# Altium schematic sheet Discrete_3V3_Linear_Regulator.SchDoc
size A; SheetNumber: 1; SheetTotal: 1
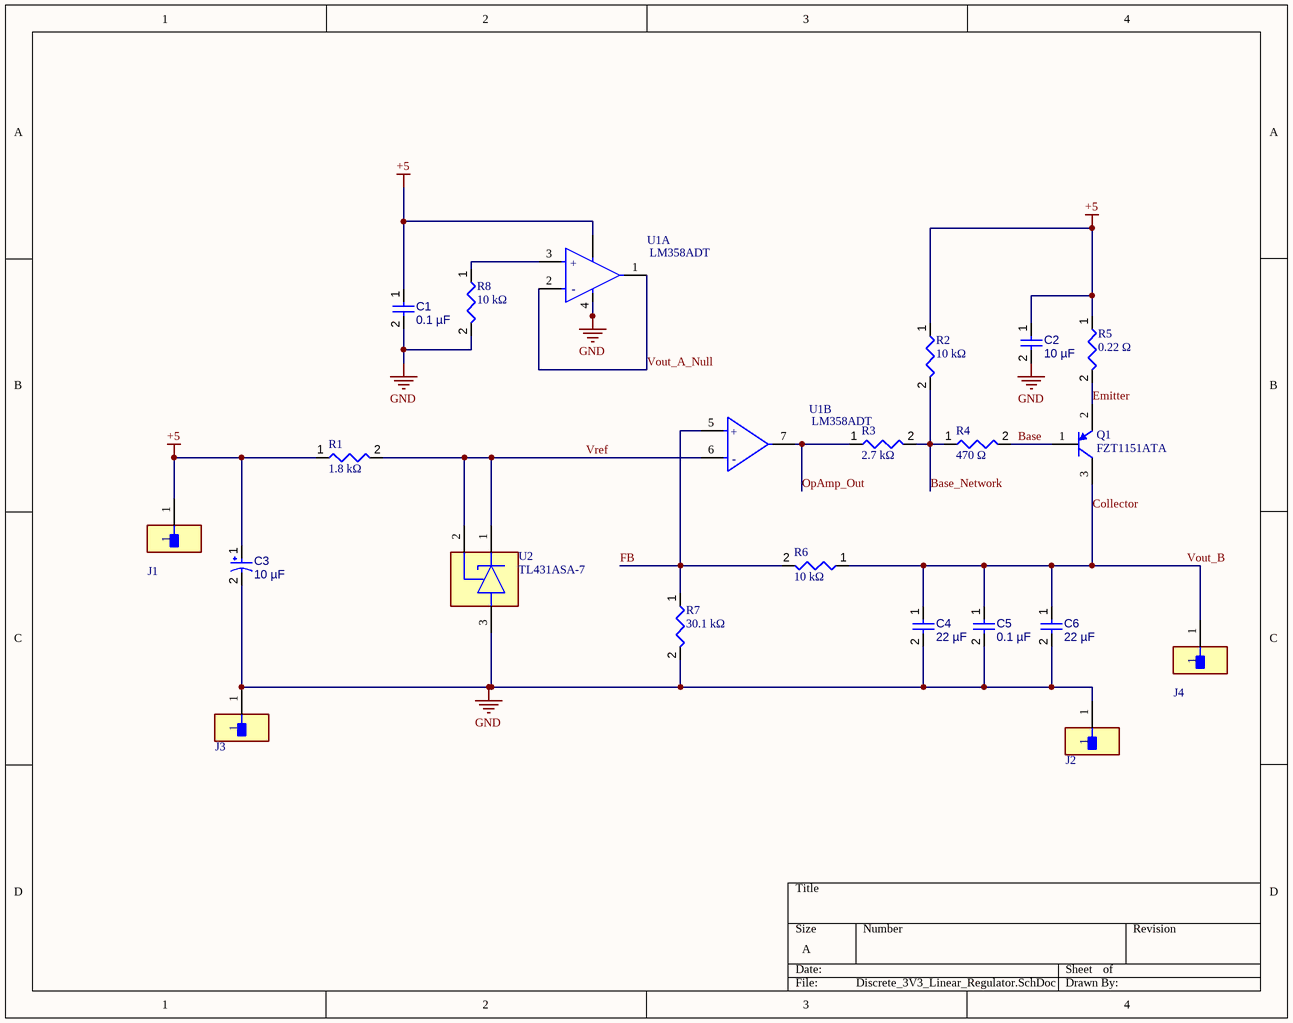
[diagram p0: Discrete_3V3_Linear_Regulator.SchDoc]

## Parts
C1  0.1 µF  [CAP_0805_IPC_M]
C2  10 µF  [CAP_0805_IPC_M]
C3  10 µF  [WCAP-PSLP_D5H5.5]
C4  22 µF  [CAP_0805_IPC_M]
C5  0.1 µF  [CAP_0805_IPC_M]
C6  22 µF  [CAP_0805_IPC_M]
J1  HTSW-101-07-L-S  [FP-HTSW-101-07-L-S-MFG]  (value not drawn)
J2  HTSW-101-07-L-S  [FP-HTSW-101-07-L-S-MFG]  (value not drawn)
J3  HTSW-101-07-L-S  [FP-HTSW-101-07-L-S-MFG]  (value not drawn)
J4  HTSW-101-07-L-S  [FP-HTSW-101-07-L-S-MFG]  (value not drawn)
Q1  FZT1151ATA  [SOT223_4P_TAB_IPC_L]
R1  1.8 kΩ  [RES_0805_IPC_M]
R2  10 kΩ  [RES_0805_IPC_M]
R3  2.7 kΩ  [RES_0805_IPC_M]
R4  470 Ω  [RES_0805_IPC_M]
R5  0.22 Ω  [RES_1206_IPC_M]
R6  10 kΩ  [RES_0805_IPC_M]
R7  30.1 kΩ  [RES_0805_IPC_M]
R8  10 kΩ  [RES_0805_IPC_M]
U1  LM358ADT  [FP-SO8-IPC_A]  (parts A,B of 2)
U2  TL431ASA-7  [FP-SOT23-MFG]

## Nets
+5: C1.1 C2.1 C3.1 J1.1 R1.1 R2.1 R5.1 U1.8(VCC+)
GND: C1.2 C2.2 C3.2 C4.2 C5.2 C6.2 J2.1 J3.1 R7.2 R8.2 U1.4(VCC-) U2.3(A)
Base: Q1.1(B) R4.2
Base_Network: R2.2 R3.2 R4.1
Collector: C4.1 C5.1 C6.1 J4.1 Q1.3(C) R6.1  [also labelled Vout_B]
Emitter: Q1.2(E) R5.2
FB: R6.2 R7.1 U1.5(In2+)
OpAmp_Out: R3.1 U1.7(Out2)
Vout_A_Null: U1.1(Out1) U1.2(In1-)
Vref: R1.2 U1.6(In2-) U2.1(C) U2.2(REF)
NetR8_1: R8.1 U1.3(In1+)

## Notes on the sheet
- (in symbol CMP-12131-000002-1, part A) +; -
- (in symbol CMP-12131-000002-1, part B) +; -

## Library data of the parts
C1 C2 C4 C5 = C: Generic non-polarized capacitor (ceramic/film), value defined per instance; Supplier: DigiKey
  C1 C5: Supplier Part Number: 490-16471-1-ND
  C2: Supplier Part Number: 445-12654-1-ND
  C4: Supplier Part Number: 445-5723-1-ND
C3 = C_POL: WCAP-PSLP Radial Can - SMD Aluminum Polymer Capacitor 0.197Dia 5.00mm ±20% 100muF 10V; Manufacturer: Wurth Elektronik; Manufacturer Part Number: 875105242010; Value: 100µF; Dissipation Factor: 8%; ESR (Equivalent Series Resistance): 30mΩ; Leakage Current: 300µA; Life (Hours): 2000hours; Pitch: 5.3mm; Polarity: Polar; Ripple Current: 1.97A; Supplier: DigiKey; Supplier Part Number: 732-6410-1-ND; RoHS: Compliant; Category: Polymer Capacitors; Stock: 19542; Pricing: 1=0.6, 50=0.508, 100=0.441, 250=0.392, 500=0.343 (USD); Case/Package: Radial; Diameter: 5mm; Height: 5.5mm; Height - Seated (Max): 5.5118mm; Length: 5.5mm; Material: Polymer; Max Operating Temperature: 105°C; Min Operating Temperature: -55°C; Mounting Technology: Surface Mount; Packaging: Tape & Reel (TR); REACH SVHC: Unknown; Tolerance: 20%; Voltage Rating: 10V; Voltage Rating (DC): 10V; Width: 5.3mm; ComponentLink1URL: https://datasheet.octopart.com:443/875105242010-W%C3%BCrth-Elektronik-datasheet-37144755.pdf?src-supplier=Wurth+Elektronik; ComponentLink1Description: https://datasheet.octopart.com:443/875105242010-W%C3%BCrth-Elektronik-datasheet-37144755.pdf?src-supplier=Wurth+Elektronik; ComponentLink2URL: https://datasheet.octopart.com:443/875105242010-Wurth-Elektronik-datasheet-181970813.pdf?src-supplier=Future+Electronics; ComponentLink2Description: https://datasheet.octopart.com:443/875105242010-Wurth-Elektronik-datasheet-181970813.pdf?src-supplier=Future+Electronics; Supplier 1: Newark; Supplier Part Number 1: 875105242010
C6 = C: Adjustable based on output requirements; Supplier: DigiKey; Supplier Part Number: 445-5723-1-ND
J1-J4 = CMP-02766-001464-1: CONN HEADER VERT 1POS; Number of Contacts: 1; Max Voltage Rating (AC): 550V; Gender: Male; Max Current Rating: 7.6A; Contact Material: Bronze; REACH SVHC: No SVHC; Contact Plating: Gold; Length: 2.54mm; Housing Color: Natural; Number of Rows: 1; Orientation: Straight; Max Operating Temperature: 125°C; Min Operating Temperature: -55°C; RoHS Compliant: Yes; Housing Material: Polymer; Packaging: Bulk; Depth: 2.48mm; Termination: Solder; Radiation Hardening: No; Supplier: DigiKey; Supplier Part Number: SAM15192-ND
Q1 = BJT_PNP: Generic PNP BJT transistor symbol (discrete); Supplier: DigiKey; Supplier Part Number: FZT1151ACT-ND
R1-R8 = R: Generic resistor, value defined per instance
U1 = CMP-12131-000002-1: IC OPAMP GP 2 CIRCUIT 8SO; Manufacturer: STMicroelectronics; Min Dual Supply Voltage: 1.5V; Standoff Height: 0.1mm; Number Of Channels: 2; Max Supply Voltage: 30V; Nominal Supply Current: 0.7mA; Max Dual Supply Voltage: 15V; Voltage Gain: 100V/mV; Gain Bandwidth: 1.1MHz; Output Current Per Channel: 50-20000uA; Input Offset Voltage: 1mV; Input Bias Current: 0.02uA; Max Junction Temp: +150°C; Min Supply Voltage: 3V; Device Class L1: Integrated Circuits (ICs); Manufacturer Part Number: LM358ADT; Device Class L2: Linear ICs; RoHS: TRUE; Lead Free: Yes; Height: 1.75mm; Automotive: No; Temperature Range Low: 0°C; Mouser Description: In a Pack of 20, LM358ADT STMicroelectronics, Low Power, Op Amp, 1.1MHz, 5 ? 28 V, 8-Pin SOIC; ComponentLink2URL: https://www.st.com/content/ccc/resource/technical/document/datasheet/61/46/87/01/98/ed/44/c5/CD00000464.pdf/files/CD00000464.pdf/jcr:content/translations/en.CD00000464.pdf; Category: IC; Temperature: 0°C to +70°C; Octopart: https://octopart.com/lm358adt-stmicroelectronics-410420; Digikey Description: IC OPAMP GP 2 CIRCUIT 8SO; Device Class L3: Amplifiers - Op Amps; ComponentLink2Description: Datasheet; Temperature Range High: +70°C; Package: SO8; Supplier: DigiKey; Supplier Part Number: 497-1590-1-ND
U2 = CMP-12755-000001-1: IC VREF SHUNT ADJ SOT23-3; Manufacturer: DIODES INC.; Standoff Height: 0.013mm; Max Power Dissipation: 330mW; Max Junction Temp: +150°C; Output Type: AdjustableProgrammable; Octopart: https://octopart.com/tl431asa-7-diodes+inc.-18832779; Automotive: No; Digikey Description: IC VREF SHUNT ADJ SOT23-3; Temperature: to +150°C; Ambient Temperature Range High: +125°C; Ipc Land Pattern Name: SOT92P240X102-3; ComponentLink2URL: https://www.diodes.com/assets/Datasheets/TL431_432.pdf; RoHS: TRUE; Manufacturer Part Number: TL431ASA-7; Reference Type: Shunt; Mouser Description: V-Ref Adjustable 2.495V to 36V 100mA 3-Pin SOT-23 T/R; Package: SOT23; Ambient Temperature Range Low: -40°C; Device Class L3: Voltage References; Temperature Range High: +150°C; ComponentLink2Description: Datasheet; Footprint Url: https://www.diodes.com/assets/Package-Files/SOT23.pdf; Category: IC; Device Class L2: Power Management ICs; Device Class L1: Integrated Circuits (ICs); Lead Free: Yes; Height: 1.1mm; Supplier: DigiKey; Supplier Part Number: TL431ASA-7DICT-ND